# Altium project PCB_Project1_vitrixe.PrjPCB
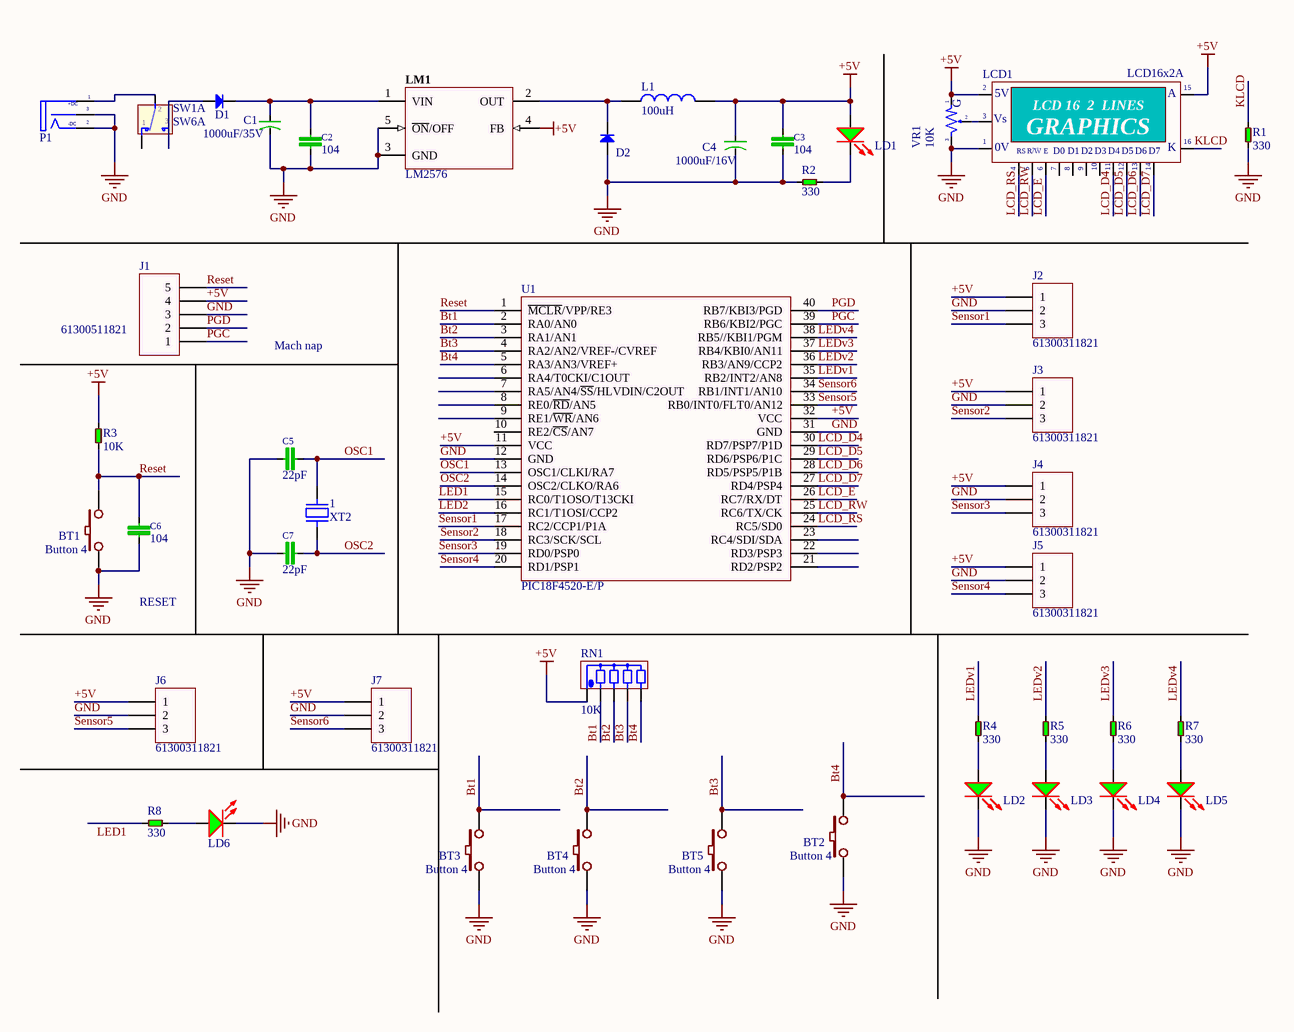
[diagram p0: Sheet1_vitrixe.SchDoc]
1 sheet, 44 parts. Net scope: global (net labels, ports and power ports of the same name join across sheets).
Board file: PCB_project_vitrixe.PcbDoc

## Sheet Sheet1_vitrixe.SchDoc
size B

### Parts
1  XT2  [XT ABLS]
BT1  Button 4  [BT-4P0606A2V]
BT2  Button 4  [BT-4P0606A2V]
BT3  Button 4  [BT-4P0606A2V]
BT4  Button 4  [BT-4P0606A2V]
BT5  Button 4  [BT-4P0606A2V]
C1  1000uF/35V  [CAP 130D50V]
C2  104  [CAP 0805/2012]
C3  104  [CAP 0805/2012]
C4  1000uF/16V  [CAP 100D50V]
C5  22pF  [CAP 0805/2012]
C6  104  [CAP 0805/2012]
C7  22pF  [CAP 0805/2012]
D1  DIODE SMD  [DIO 1S2P1713H]  (value not drawn)
D2  DIODE SMD  [DIO 1S2P1713H]  (value not drawn)
J1  61300511821  [61300511821]
J2  61300311821  [61300311821]
J3  61300311821  [61300311821]
J4  61300311821  [61300311821]
J5  61300311821  [61300311821]
J6  61300311821  [61300311821]
J7  61300311821  [61300311821]
L1  100uH  [IND 1313-2P]
LCD1  LCD16x2A  [LCD-C1602N1Z BLUE]
LD1  LED DIP  [LED 5MM GREEN]  (value not drawn)
LD2  LED DIP  [LED 5MM GREEN]  (value not drawn)
LD3  LED DIP  [LED 5MM GREEN]  (value not drawn)
LD4  LED DIP  [LED 5MM GREEN]  (value not drawn)
LD5  LED DIP  [LED 5MM GREEN]  (value not drawn)
LD6  LED DIP  [LED 5MM GREEN]  (value not drawn)
LM1  LM2576  [TO263-5]
P1  DCIN  [POW3.50 3DFH]  (value not drawn)
R1  330  [RES 0805/2012]
R2  330  [RES 0805/2012]
R3  10K  [RES 0805/2012]
R4  330  [RES 0805/2012]
R5  330  [RES 0805/2012]
R6  330  [RES 0805/2012]
R7  330  [RES 0805/2012]
R8  330  [RES 0805/2012]
RN1  10K  [RES P4]
SW1  SW6A  [SW6]  (part A of 2)
U1  PIC18F4520-E/P  [DIP40Q]
VR1  10K  [POTSD 3296V]

### Nets
+5V: C3.1 C4.1 J1.4 J2.1 J3.1 J4.1 J5.1 J6.1 J7.1 L1.2 LCD1.2(VDD) LCD1.15(A) LD1.1(A) LM1.4(FB) R3.1 RN1.1 U1.11(VCC) U1.32(VCC) VR1.1
GND: BT1.1 BT2.1 BT3.1 BT4.1 BT5.1 C1.2 C2.2 C3.2 C4.2 C5.2 C6.2 C7.2 D2.1(A) J1.3 J2.2 J3.2 J4.2 J5.2 J6.2 J7.2 LCD1.1(GND) LD2.2(K) LD3.2(K) LD4.2(K) LD5.2(K) LD6.2(K) LM1.3(GND) LM1.5(~{ON}/OFF) P1.2(TN) P1.3(S) R1.1 R2.1 U1.12(GND) U1.31(GND) VR1.3
Bt1: BT3.2 RN1.2 U1.2(RA0/AN0)
Bt2: BT4.2 RN1.3 U1.3(RA1/AN1)
Bt3: BT5.2 RN1.4 U1.4(RA2/AN2/VREF-/CVREF)
Bt4: BT2.2 RN1.5 U1.5(RA3/AN3/VREF+)
KLCD: LCD1.16(K) R1.2
LCD_D4: LCD1.11(D4) U1.30(RD7/PSP7/P1D)
LCD_D5: LCD1.12(D5) U1.29(RD6/PSP6/P1C)
LCD_D6: LCD1.13(D6) U1.28(RD5/PSP5/P1B)
LCD_D7: LCD1.14(D7) U1.27(RD4/PSP4)
LCD_E: LCD1.6(~{EN}) U1.26(RC7/RX/DT)
LCD_RS: LCD1.4(RS) U1.24(RC5/SD0)
LCD_RW: LCD1.5(R/~{W}) U1.25(RC6/TX/CK)
LED1: R8.2 U1.15(RC0/T1OSO/T13CKI)
LED2: U1.16(RC1/T1OSI/CCP2)
LEDv1: R4.2 U1.35(RB2/INT2/AN8)
LEDv2: R5.2 U1.36(RB3/AN9/CCP2)
LEDv3: R6.2 U1.37(RB4/KBI0/AN11)
LEDv4: R7.2 U1.38(RB5//KBI1/PGM)
OSC1: 1.1 C5.1 U1.13(OSC1/CLKI/RA7)
OSC2: 1.2 C7.1 U1.14(OSC2/CLKO/RA6)
PGC: J1.1 U1.39(RB6/KBI2/PGC)
PGD: J1.2 U1.40(RB7/KBI3/PGD)
Reset: BT1.2 C6.1 J1.5 R3.2 U1.1(~{MCLR}/VPP/RE3)
Sensor1: J2.3 U1.17(RC2/CCP1/P1A)
Sensor2: J3.3 U1.18(RC3/SCK/SCL)
Sensor3: J4.3 U1.19(RD0/PSP0)
Sensor4: J5.3 U1.20(RD1/PSP1)
Sensor5: J6.3 U1.33(RB0/INT0/FLT0/AN12)
Sensor6: J7.3 U1.34(RB1/INT1/AN10)
NetC1_1: C1.1 C2.1 D1.2(K) LM1.1(VIN)
NetD1_1: D1.1(A) SW1.3
NetD2_2: D2.2(K) L1.1 LM1.2(OUT)
NetLCD1_3: LCD1.3(VEE) VR1.2
NetLD1_2: LD1.2(K) R2.2
NetLD2_1: LD2.1(A) R4.1
NetLD3_1: LD3.1(A) R5.1
NetLD4_1: LD4.1(A) R6.1
NetLD5_1: LD5.1(A) R7.1
NetLD6_1: LD6.1(A) R8.1
NetP1_1: P1.1(T) SW1.2

Not connected (* = marked no-connect by the designer): LCD1 7(D0) 8(D1) 9(D2) 10(D3); SW1 1; U1 6(RA4/T0CKI/C1OUT) 7(RA5/AN4/~{SS}/HLVDIN/C2OUT) 8(RE0/~{RD}/AN5) 9(RE1/~{WR}/AN6) 10(RE2/~{CS}/AN7) 21(RD2/PSP2) 22(RD3/PSP3) 23(RC4/SDI/SDA)

### Notes on the sheet
- Mach nap
- RESET
- (in symbol DCIN) +DC; -DC
- (in symbol LCD16x2A) 5V; LCD 16  2  LINES; Vs; GRAPHICS; |; 0V; R/W; E
- (in symbol POT SINGLE) G

### Library data of the parts
1 = XT2: 20MHz ±20ppm Crystal 18pF 40 Ohm -20°C ~ 70°C  Surface Mount HC49/US
BT1-BT5 = Button 4: Button 4 Pin no Sheld
C1 = Cap 1000uF/35V: Uxcell 10 Pcs 35V 1000Uf 105C Radial Lead Electrolytic Capacitor 13 mm x 20mm
C2 C3 C5-C7 = Capl Semi: CAP Semi
C4 = Cap 1000uF/16V: Nichicon  UVZ1C102MPD-20 Aluminum Electrolytic Capacitors - Leaded 16V, 1000uF, 10 mm x 16 mm, 20% Tolerance, 5LS
D1 D2 = DIODE SMD: STMICROELECTRONICS         1N5711            Small Signal Schottky Diode, Single, 70 V, 15 mA, 410 mV, 200 C; Revision: July-2002: Re-released for DXP Platform.
J1 = JP5 2.54MM: 2.54 mm Socket Header, 05p; PublishedDate: July 2016; Publisher: Wurth Elektronik; ComponentLink1Description: Manufacturer; ComponentLink1URL: http://www.we-online.de; ComponentLink2Description: Datasheet; ComponentLink2URL: http://katalog.we-online.de/em/datasheet/6130xx11821.pdf; PartNumber: 61300511821; PinNumber: 05p
J2-J7 = JP3 2.54MM: 2.54 mm Socket Header, 03p; PublishedDate: July 2016; Publisher: Wurth Elektronik; ComponentLink1Description: Manufacturer; ComponentLink1URL: http://www.we-online.de; ComponentLink2Description: Datasheet; ComponentLink2URL: http://katalog.we-online.de/em/datasheet/6130xx11821.pdf; PartNumber: 61300311821; PinNumber: 03p
L1 = IND 100uH: Inductor, Ferrite Bead 1K@100MHz 300mA; PartNumber: 744910025; PublishedDate: Aug 2016; Publisher: Wurth Elektronik; ComponentLink1Description: Manufacturer; ComponentLink1URL: http://www.we-online.de; ComponentLink2Description: Datasheet; ComponentLink2URL: http://katalog.we-online.de/pbs/datasheet/744910025.pdf; Value: 100uH; Size: 1322
LCD1 = LCD16x2A: LCD dipslay 16 char, 2 line
LD1-LD6 = LED DIP: DIALIGHT         5988270107F            LED, Green, SMD, 20 mA, 2 V, 570 nm
LM1 = LM2576: IC REG MULT CONFIG INV ADJ D2PAK
P1 = DCIN: CONN POWER JACK 2.1X5.5MM SMD
R1 R2 R4-R8 = Resistor SMD: RES SMD 0.0 OHM JUMPER 1/8W 0805; Value: 10K
R3 = Resistor SMD: RES SMD 0.0 OHM JUMPER 1/8W 0805; Value: 10K
RN1 = Respack 4: Value: 10K
SW1 = SW6A: SW-DTDP - 6 Pin; Value: SW6
U1 = PIC18F4520-E/P: IC MCU FLASH 16KX16 40DIP
VR1 = POT SINGLE: Var Resistor